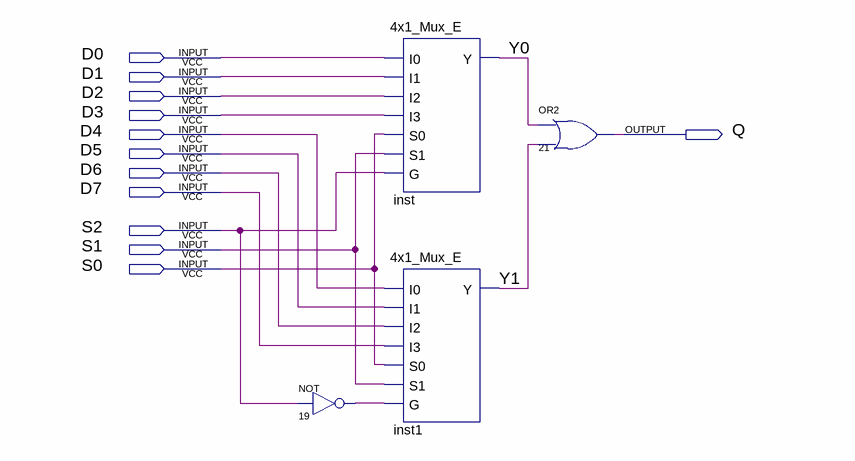
[diagram p0: schematic sheet]
// Quartus schematic 8x1_Mux_S.bdf as structural Verilog: 4 symbols, 12 pins
module \8x1_Mux_S  (
  input  D0,
  input  D1,
  input  D2,
  input  D3,
  input  D4,
  input  D5,
  input  D6,
  input  D7,
  input  S2,
  input  S1,
  input  S0,
  output Q
);

  wire n19_out, Y0, Y1;

  not u_19 (n19_out, S2);
  \4x1_Mux_E  inst (.I0(D0), .I1(D1), .I2(D2), .I3(D3), .S0(S0), .S1(S1), .G(S2), .Y(Y0));
  \4x1_Mux_E  inst1 (.I0(D4), .I1(D5), .I2(D6), .I3(D7), .S0(S0), .S1(S1), .G(n19_out), .Y(Y1));
  or u_21 (Q, Y0, Y1);
endmodule
